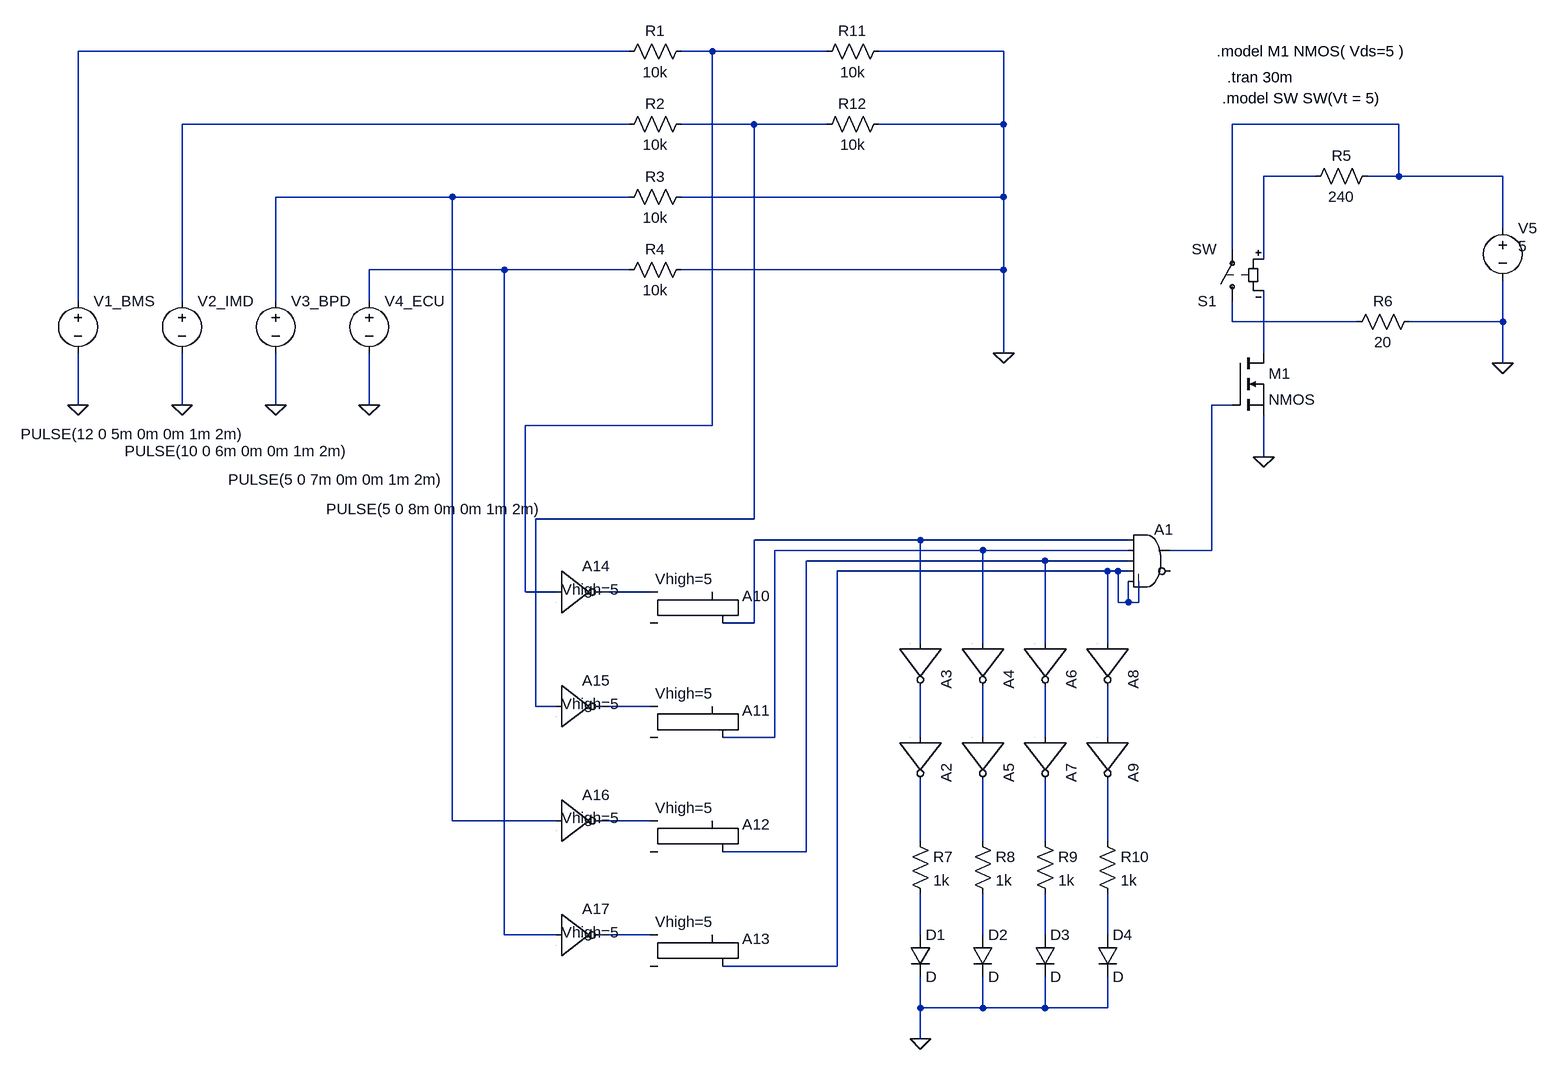
[diagram p0: schematic LT SRB.asc]
LT SRB.asc, the LTspice schematic file:
Version 4
SHEET 1 1560 1588
WIRE 160 0 -688 0
WIRE 288 0 240 0
WIRE 464 0 288 0
WIRE 736 0 544 0
WIRE 160 112 -528 112
WIRE 352 112 240 112
WIRE 464 112 352 112
WIRE 736 112 736 0
WIRE 736 112 544 112
WIRE 1344 112 1088 112
WIRE 1216 192 1136 192
WIRE 1344 192 1344 112
WIRE 1344 192 1296 192
WIRE 1504 192 1344 192
WIRE -112 224 -384 224
WIRE 160 224 -112 224
WIRE 736 224 736 112
WIRE 736 224 240 224
WIRE 1504 272 1504 192
WIRE 1088 304 1088 112
WIRE 1136 320 1136 192
WIRE -32 336 -240 336
WIRE 160 336 -32 336
WIRE 736 336 736 224
WIRE 736 336 240 336
WIRE -688 384 -688 0
WIRE -528 384 -528 112
WIRE -384 384 -384 224
WIRE -240 384 -240 336
WIRE 1088 416 1088 384
WIRE 1280 416 1088 416
WIRE 1504 416 1504 352
WIRE 1504 416 1360 416
WIRE 736 464 736 336
WIRE 1136 464 1136 368
WIRE 1504 480 1504 416
WIRE -688 544 -688 464
WIRE -528 544 -528 464
WIRE -384 544 -384 464
WIRE -240 544 -240 464
WIRE 1088 544 1056 544
WIRE 288 576 288 0
WIRE 288 576 0 576
WIRE 1136 624 1136 560
WIRE 352 720 352 112
WIRE 352 720 16 720
WIRE 608 752 352 752
WIRE 928 752 608 752
WIRE 704 768 384 768
WIRE 928 768 704 768
WIRE 1056 768 1056 544
WIRE 1056 768 992 768
WIRE 800 784 432 784
WIRE 928 784 800 784
WIRE 896 800 480 800
WIRE 912 800 896 800
WIRE 928 800 912 800
WIRE 0 832 0 576
WIRE 48 832 0 832
WIRE 192 832 112 832
WIRE 912 848 912 800
WIRE 928 848 928 816
WIRE 928 848 912 848
WIRE 944 848 944 816
WIRE 944 848 928 848
WIRE 352 880 352 752
WIRE 352 880 304 880
WIRE 608 912 608 752
WIRE 704 912 704 768
WIRE 800 912 800 784
WIRE 896 912 896 800
WIRE 16 1008 16 720
WIRE 48 1008 16 1008
WIRE 192 1008 112 1008
WIRE 384 1056 384 768
WIRE 384 1056 304 1056
WIRE 608 1056 608 976
WIRE 704 1056 704 976
WIRE 800 1056 800 976
WIRE 896 1056 896 976
WIRE -112 1184 -112 224
WIRE 48 1184 -112 1184
WIRE 192 1184 112 1184
WIRE 608 1216 608 1120
WIRE 704 1216 704 1120
WIRE 800 1216 800 1120
WIRE 896 1216 896 1120
WIRE 432 1232 432 784
WIRE 432 1232 304 1232
WIRE -32 1360 -32 336
WIRE 48 1360 -32 1360
WIRE 192 1360 112 1360
WIRE 608 1360 608 1296
WIRE 704 1360 704 1296
WIRE 800 1360 800 1296
WIRE 896 1360 896 1296
WIRE 480 1408 480 800
WIRE 480 1408 304 1408
WIRE 608 1472 608 1424
WIRE 704 1472 704 1424
WIRE 704 1472 608 1472
WIRE 800 1472 800 1424
WIRE 800 1472 704 1472
WIRE 896 1472 896 1424
WIRE 896 1472 800 1472
WIRE 608 1520 608 1472
FLAG 736 464 0
FLAG 1504 480 0
FLAG 608 1520 0
FLAG -688 544 0
FLAG -528 544 0
FLAG -384 544 0
FLAG -240 544 0
FLAG 1136 624 0
SYMBOL res 256 -16 R90
WINDOW 0 0 56 VBottom 2
WINDOW 3 32 56 VTop 2
SYMATTR InstName R1
SYMATTR Value 10k
SYMBOL res 256 96 R90
WINDOW 0 0 56 VBottom 2
WINDOW 3 32 56 VTop 2
SYMATTR InstName R2
SYMATTR Value 10k
SYMBOL res 256 208 R90
WINDOW 0 0 56 VBottom 2
WINDOW 3 32 56 VTop 2
SYMATTR InstName R3
SYMATTR Value 10k
SYMBOL res 256 320 R90
WINDOW 0 0 56 VBottom 2
WINDOW 3 32 56 VTop 2
SYMATTR InstName R4
SYMATTR Value 10k
SYMBOL res 1312 176 R90
WINDOW 0 0 56 VBottom 2
WINDOW 3 32 56 VTop 2
SYMATTR InstName R5
SYMATTR Value 240
SYMBOL res 1376 400 R90
WINDOW 0 0 56 VBottom 2
WINDOW 3 32 56 VTop 2
SYMATTR InstName R6
SYMATTR Value 20
SYMBOL res 592 1200 R0
SYMATTR InstName R7
SYMATTR Value 1k
SYMBOL res 688 1200 R0
SYMATTR InstName R8
SYMATTR Value 1k
SYMBOL res 784 1200 R0
SYMATTR InstName R9
SYMATTR Value 1k
SYMBOL res 880 1200 R0
SYMATTR InstName R10
SYMATTR Value 1k
SYMBOL Digital\\and 960 720 R0
SYMATTR InstName A1
SYMBOL Digital\\inv 672 1056 R90
SYMATTR InstName A2
SYMBOL Digital\\inv 672 912 R90
SYMATTR InstName A3
SYMBOL Digital\\inv 768 912 R90
SYMATTR InstName A4
SYMBOL Digital\\inv 768 1056 R90
SYMATTR InstName A5
SYMBOL Digital\\inv 864 912 R90
SYMATTR InstName A6
SYMBOL Digital\\inv 864 1056 R90
SYMATTR InstName A7
SYMBOL Digital\\inv 960 912 R90
SYMATTR InstName A8
SYMBOL Digital\\inv 960 1056 R90
SYMATTR InstName A9
SYMBOL diode 592 1360 R0
SYMATTR InstName D1
SYMBOL diode 688 1360 R0
SYMATTR InstName D2
SYMBOL diode 784 1360 R0
SYMATTR InstName D3
SYMBOL diode 880 1360 R0
SYMATTR InstName D4
SYMBOL voltage -688 368 R0
WINDOW 3 -88 221 Left 2
WINDOW 123 0 0 Left 2
WINDOW 39 0 0 Left 2
SYMATTR Value PULSE(12 0 5m 0m 0m 1m 2m)
SYMATTR InstName V1_BMS
SYMBOL voltage -528 368 R0
WINDOW 3 -88 247 Left 2
WINDOW 123 0 0 Left 2
WINDOW 39 0 0 Left 2
SYMATTR Value PULSE(10 0 6m 0m 0m 1m 2m)
SYMATTR InstName V2_IMD
SYMBOL voltage -384 368 R0
WINDOW 3 -73 291 Left 2
WINDOW 123 0 0 Left 2
WINDOW 39 0 0 Left 2
SYMATTR Value PULSE(5 0 7m 0m 0m 1m 2m)
SYMATTR InstName V3_BPD
SYMBOL voltage -240 368 R0
WINDOW 3 -66 336 Left 2
WINDOW 123 0 0 Left 2
WINDOW 39 0 0 Left 2
SYMATTR Value PULSE(5 0 8m 0m 0m 1m 2m)
SYMATTR InstName V4_ECU
SYMBOL voltage 1504 256 R0
WINDOW 3 24 44 Left 2
WINDOW 123 0 0 Left 2
WINDOW 39 0 0 Left 2
SYMATTR Value 5
SYMATTR InstName V5
SYMBOL nmos 1088 464 R0
SYMATTR InstName M1
SYMBOL sw 1088 400 R180
SYMATTR InstName S1
SYMBOL res 448 16 R270
WINDOW 0 32 56 VTop 2
WINDOW 3 0 56 VBottom 2
SYMATTR InstName R11
SYMATTR Value 10k
SYMBOL res 448 128 R270
WINDOW 0 32 56 VTop 2
WINDOW 3 0 56 VBottom 2
SYMATTR InstName R12
SYMATTR Value 10k
SYMBOL Digital\\srflop 240 784 R0
WINDOW 3 -40 28 Left 2
SYMATTR InstName A10
SYMATTR Value Vhigh=5
SYMBOL Digital\\srflop 240 960 R0
WINDOW 3 -40 28 Left 2
SYMATTR InstName A11
SYMATTR Value Vhigh=5
SYMBOL Digital\\srflop 240 1136 R0
WINDOW 3 -40 28 Left 2
SYMATTR InstName A12
SYMATTR Value Vhigh=5
SYMBOL Digital\\srflop 240 1312 R0
WINDOW 3 -40 28 Left 2
SYMATTR InstName A13
SYMATTR Value Vhigh=5
SYMBOL Digital\\inv 48 768 R0
WINDOW 3 8 60 Left 2
SYMATTR InstName A14
SYMATTR Value Vhigh=5
SYMBOL Digital\\inv 48 944 R0
WINDOW 3 8 60 Left 2
SYMATTR InstName A15
SYMATTR Value Vhigh=5
SYMBOL Digital\\inv 48 1120 R0
WINDOW 3 8 60 Left 2
SYMATTR InstName A16
SYMATTR Value Vhigh=5
SYMBOL Digital\\inv 48 1296 R0
WINDOW 3 8 60 Left 2
SYMATTR InstName A17
SYMATTR Value Vhigh=5
TEXT 1072 72 Left 2 !.model SW SW(Vt = 5)
TEXT 1080 40 Left 2 !.tran 30m
TEXT 1064 0 Left 2 !.model M1 NMOS( Vds=5 )

The netlist it stands for:
* LT SRB.asc
R1 N002 N001 10k
R2 N004 N003 10k
R3 0 N007 10k
R4 0 N008 10k
R5 N005 N006 240
R6 0 N009 20
R7 N023 N028 1k
R8 N024 N029 1k
R9 N025 N030 1k
R10 N026 N031 1k
A1 N012 N013 N014 N015 N015 N015 N011 N015 AND
A2 N018 0 0 0 0 N023 0 0 BUF
A3 N012 0 0 0 0 N018 0 0 BUF
A4 N013 0 0 0 0 N019 0 0 BUF
A5 N019 0 0 0 0 N024 0 0 BUF
A6 N014 0 0 0 0 N020 0 0 BUF
A7 N020 0 0 0 0 N025 0 0 BUF
A8 N015 0 0 0 0 N021 0 0 BUF
A9 N021 0 0 0 0 N026 0 0 BUF
D1 N028 0 D
D2 N029 0 D
D3 N030 0 D
D4 N031 0 D
V1_BMS N001 0 PULSE(12 0 5m 0m 0m 1m 2m)
V2_IMD N003 0 PULSE(10 0 6m 0m 0m 1m 2m)
V3_BPD N007 0 PULSE(5 0 7m 0m 0m 1m 2m)
V4_ECU N008 0 PULSE(5 0 8m 0m 0m 1m 2m)
V5 N005 0 5
M1 N010 N011 0 0 NMOS
S1 N009 N005 N006 N010 SW
R11 N002 0 10k
R12 N004 0 10k
A10 N016 0 0 0 0 N012 0 0 SRFLOP Vhigh=5
A11 N017 0 0 0 0 N013 0 0 SRFLOP Vhigh=5
A12 N022 0 0 0 0 N014 0 0 SRFLOP Vhigh=5
A13 N027 0 0 0 0 N015 0 0 SRFLOP Vhigh=5
A14 N002 0 0 0 0 N016 0 0 BUF Vhigh=5
A15 N004 0 0 0 0 N017 0 0 BUF Vhigh=5
A16 N007 0 0 0 0 N022 0 0 BUF Vhigh=5
A17 N008 0 0 0 0 N027 0 0 BUF Vhigh=5
.model D D
.lib standard.dio
.model NMOS NMOS
.model PMOS PMOS
.lib standard.mos
.model SW SW(Vt = 5)
.tran 30m
.model M1 NMOS( Vds=5 )
.backanno
.end